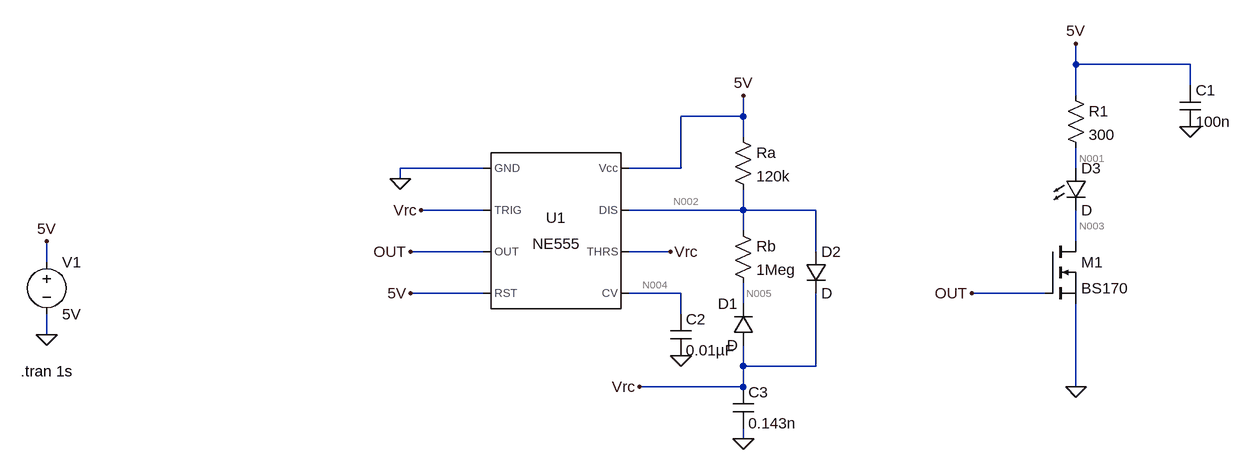
[diagram p0: schematic Draft2.asc]
Draft2.asc, the LTspice schematic file:
Version 4.1
SHEET 1 2868 900
WIRE 1824 -192 1824 -224
WIRE 2000 -192 1824 -192
WIRE 2000 -160 2000 -192
WIRE 1824 -144 1824 -192
WIRE 1312 -112 1312 -144
WIRE 1312 -112 1216 -112
WIRE 1312 -80 1312 -112
WIRE 912 -32 784 -32
WIRE 1216 -32 1216 -112
WIRE 1216 -32 1136 -32
WIRE 1824 -32 1824 -64
WIRE 784 -16 784 -32
WIRE 912 32 816 32
WIRE 1312 32 1312 0
WIRE 1312 32 1136 32
WIRE 1424 32 1312 32
WIRE 1312 64 1312 32
WIRE 1824 80 1824 32
WIRE 912 96 800 96
WIRE 1200 96 1136 96
WIRE 1424 96 1424 32
WIRE 240 112 240 80
WIRE 912 160 800 160
WIRE 1216 160 1136 160
WIRE 1776 160 1664 160
WIRE 1312 176 1312 144
WIRE 1216 192 1216 160
WIRE 240 224 240 192
WIRE 1312 272 1312 240
WIRE 1424 272 1424 160
WIRE 1424 272 1312 272
WIRE 1312 304 1312 272
WIRE 1312 304 1152 304
WIRE 1824 304 1824 176
WIRE 1312 384 1312 368
FLAG 240 224 0
FLAG 240 80 5V
FLAG 784 -16 0
FLAG 816 32 Vrc
FLAG 1200 96 Vrc
FLAG 800 96 OUT
FLAG 1216 256 0
FLAG 1312 -144 5V
FLAG 800 160 5V
FLAG 1152 304 Vrc
FLAG 1312 384 0
FLAG 1664 160 OUT
FLAG 1824 304 0
FLAG 2000 -96 0
FLAG 1824 -224 5V
SYMBOL NE555 1024 64 R0
SYMATTR InstName U1
SYMBOL voltage 240 96 R0
WINDOW 123 0 0 Left 0
WINDOW 39 0 0 Left 0
SYMATTR InstName V1
SYMATTR Value 5V
SYMBOL res 1296 -96 R0
SYMATTR InstName Ra
SYMATTR Value 120k
SYMBOL res 1296 48 R0
SYMATTR InstName Rb
SYMATTR Value 1Meg
SYMBOL cap 1200 192 R0
SYMATTR InstName C2
SYMATTR Value 0.01µF
SYMBOL cap 1296 304 R0
SYMATTR InstName C3
SYMATTR Value 0.143n
SYMBOL diode 1328 240 R180
WINDOW 0 24 64 Left 2
WINDOW 3 24 0 Left 2
SYMATTR InstName D1
SYMBOL diode 1408 96 R0
SYMATTR InstName D2
SYMBOL LED 1808 -32 R0
SYMATTR InstName D3
SYMBOL res 1808 -160 R0
SYMATTR InstName R1
SYMATTR Value 300
SYMBOL cap 1984 -160 R0
SYMATTR InstName C1
SYMATTR Value 100n
SYMBOL nmos 1776 80 R0
SYMATTR InstName M1
SYMATTR Value BS170
TEXT 200 280 Left 2 !.tran 1s

The netlist it stands for:
* Draft2.asc
X§U1 0 Vrc OUT 5V N004 Vrc N002 5V NE555  ; pins GND TRIG OUT RST CV THRS DIS Vcc
V1 5V 0 5V
Ra 5V N002 120k
Rb N002 N005 1Meg
C2 N004 0 0.01µF
C3 Vrc 0 0.143n
D1 Vrc N005 D
D2 N002 Vrc D
D3 N001 N003 D
R1 5V N001 300
C1 5V 0 100n
M1 N003 OUT 0 0 BS170
.model D D
.lib standard.dio
.model NMOS NMOS
.model PMOS PMOS
.lib standard.mos
.tran 1s
.lib NE555.sub
.backanno
.end

* Results of the author's LTspice run, read from the files saved beside the schematic
* Operating Point, zero values left out:
*   V(5v) = 5 V
*   V(n001) = 785.6 mV
*   V(n002) = 4.998 V
*   V(n003) = 62.1 mV
*   V(n004) = 3.333 V
*   V(n005) = 4.998 V
*   V(out) = 5 V
*   V(vrc) = 4.643 V
*   I(D2) = 9.287 nA
*   I(D3) = 14.05 mA
*   I(R1) = 14.05 mA
*   I(Ra) = 15.95 nA
*   I(V1) = -15.66 mA
*   Id(M1) = 14.05 mA
*   Is(M1) = -14.05 mA
*   Ix(u1:1) = -1.611 mA
*   Ix(u1:2) = 4.643 nA
*   Ix(u1:4) = 22.67 µA
*   Ix(u1:6) = 4.643 nA
*   Ix(u1:7) = 6.669 nA
*   Ix(u1:8) = 1.588 mA